# EAGLE design anaMoCo (EAGLE 6.2)
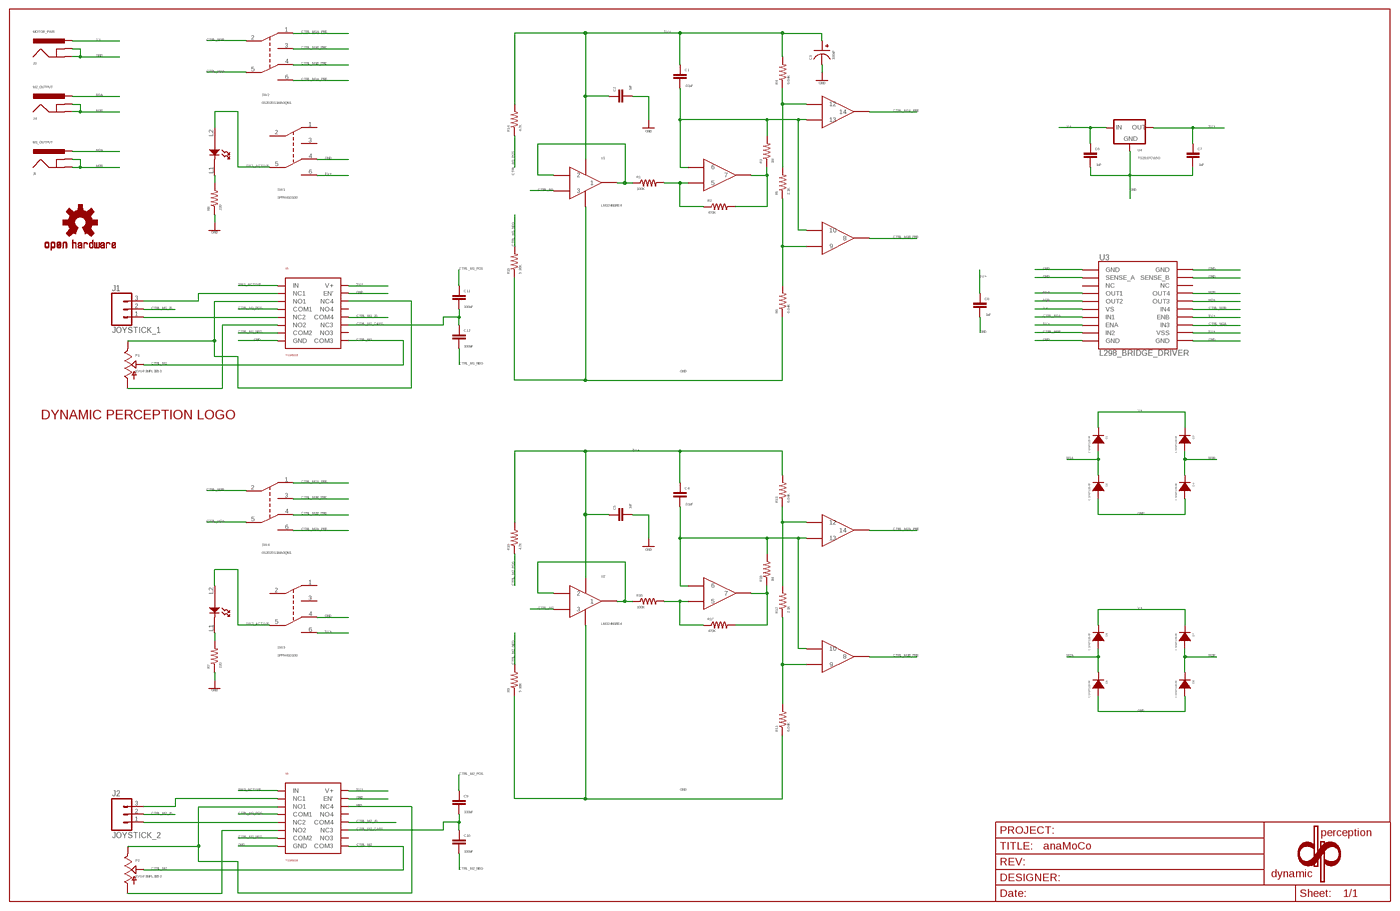
[diagram p0: schematic, sheet 1, overview]
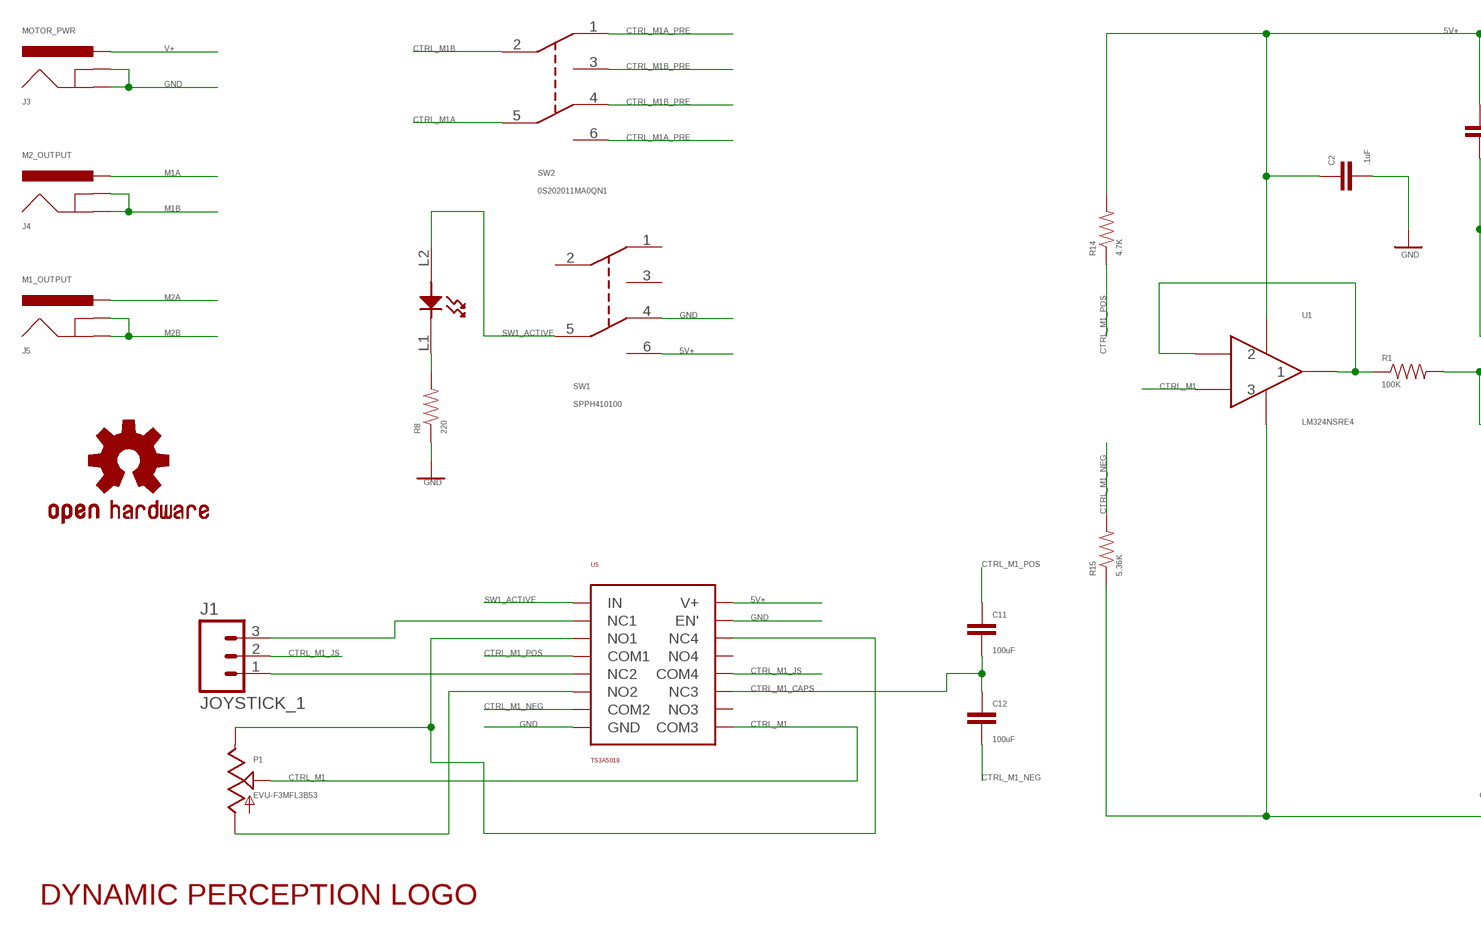
[diagram p1: schematic, sheet 1, part 1 of 4]
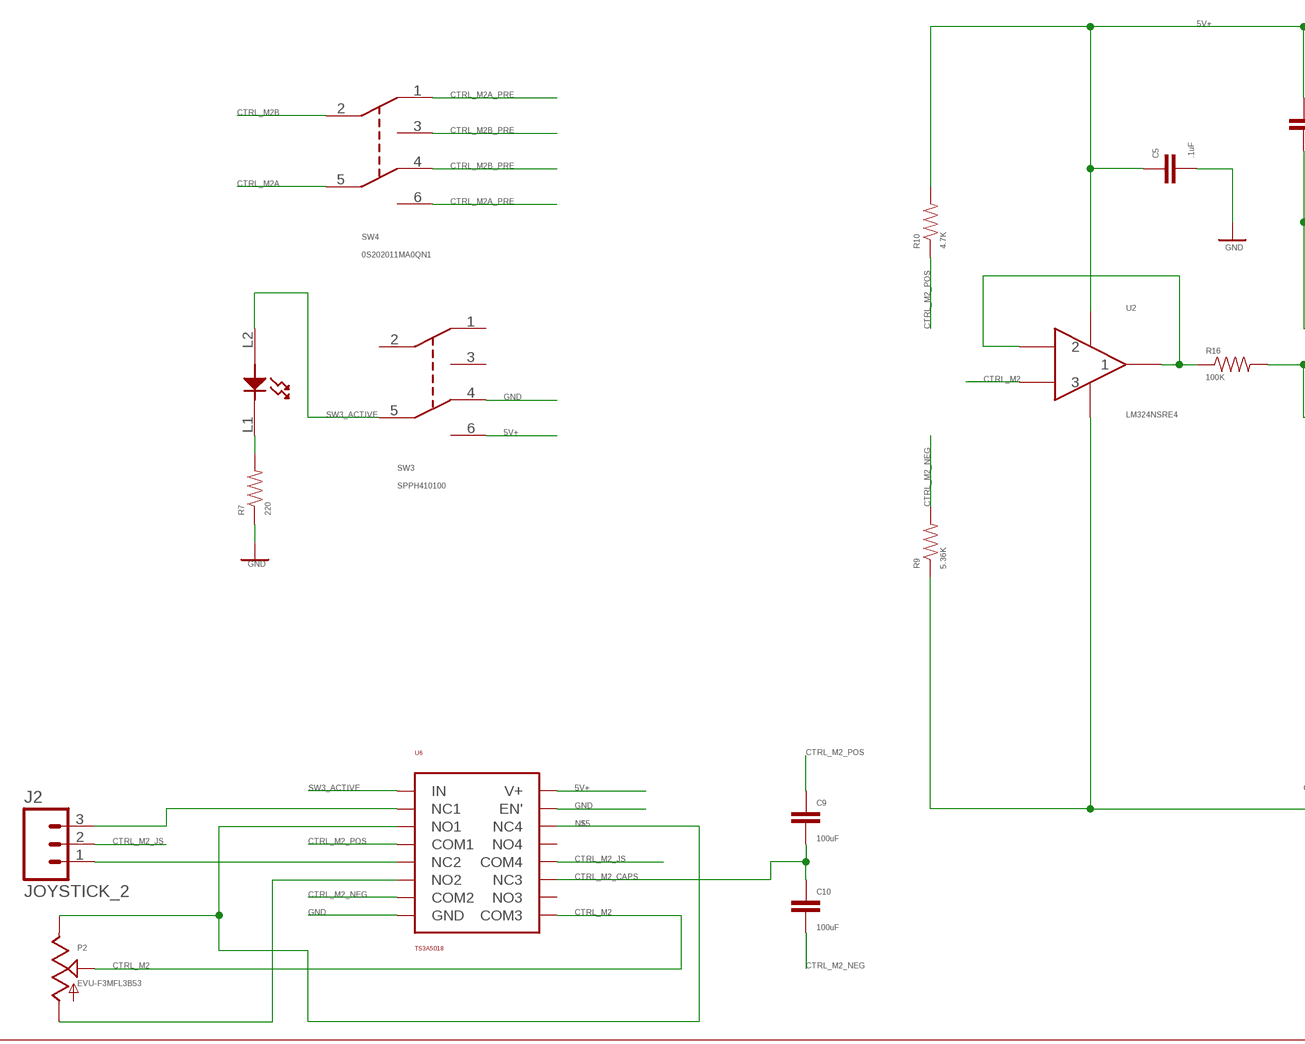
[diagram p2: schematic, sheet 1, part 2 of 4]
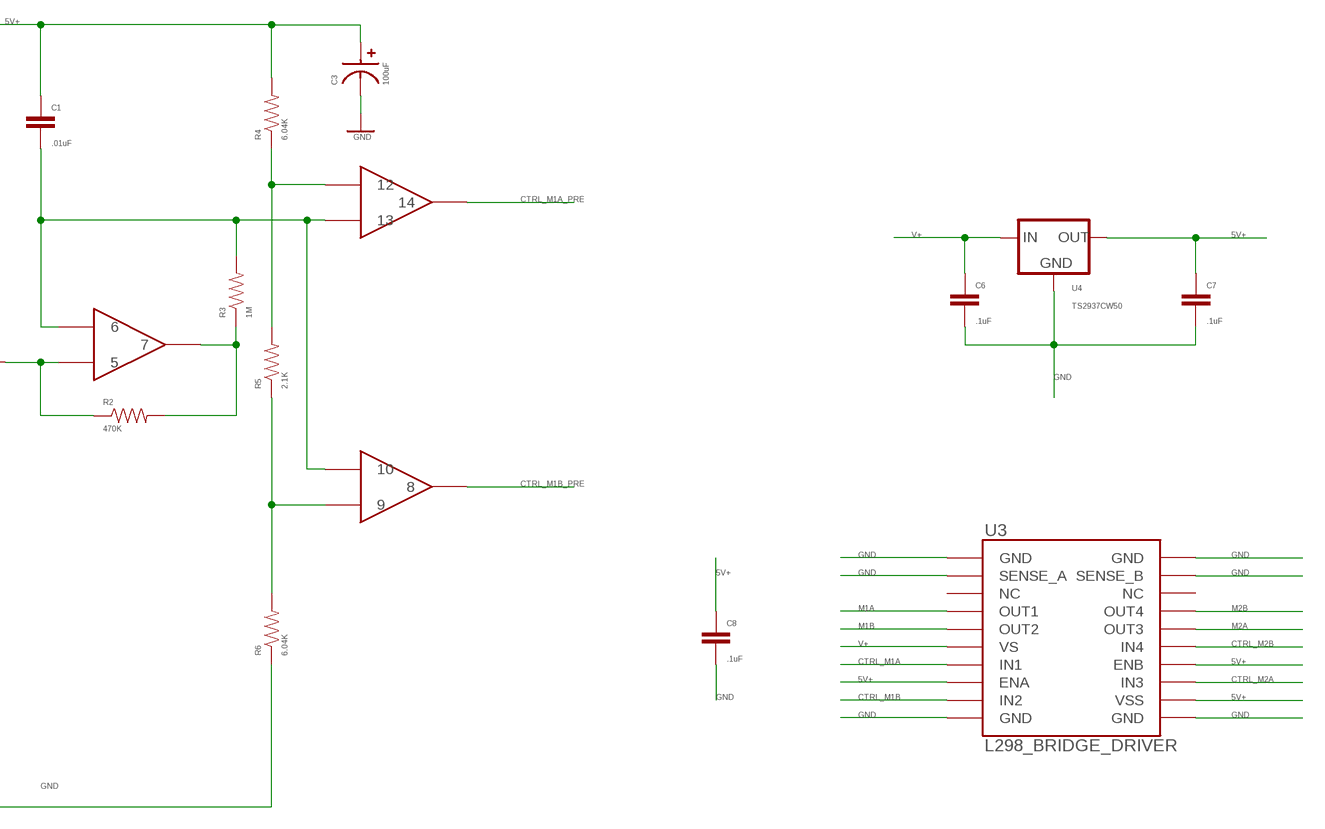
[diagram p3: schematic, sheet 1, part 3 of 4]
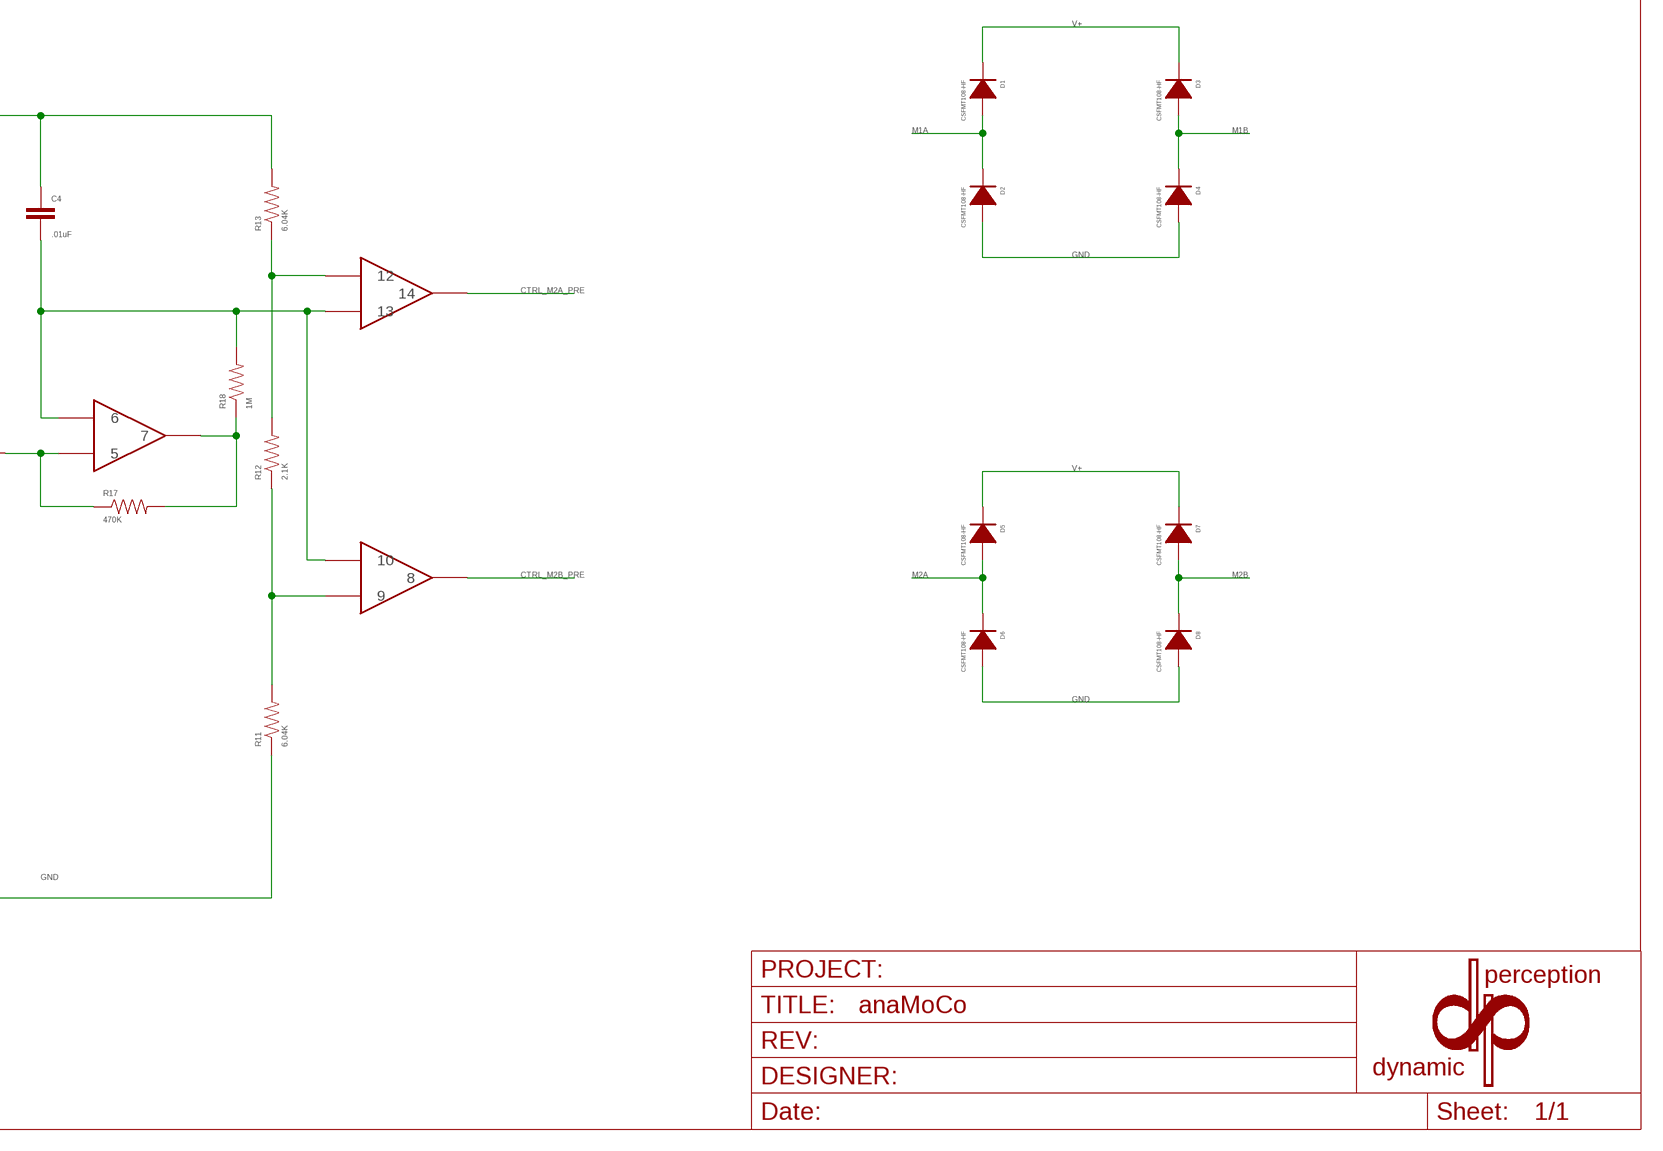
[diagram p4: schematic, sheet 1, part 4 of 4]

## Parts
C1  .01uF  CAP_NONPOL0402  [0402_CAP]
C2  .1uF  CAP_NONPOL0402  [0402_CAP]
C3  100uF  CAP_POLARIZED6.3MM_SMD  [6.3MM_DIA_CAP_SMD]
C4  .01uF  CAP_NONPOL0402  [0402_CAP]
C5  .1uF  CAP_NONPOL0402  [0402_CAP]
C6  .1uF  CAP_NONPOL0402  [0402_CAP]
C7  .1uF  CAP_NONPOL0402  [0402_CAP]
C8  .1uF  CAP_NONPOL0402  [0402_CAP]
C9  100uF  CAP1206  [1206]
C10  100uF  CAP1206  [1206]
C11  100uF  CAP1206  [1206]
C12  100uF  CAP1206  [1206]
D1  CSFMT108-HF  1N4148WSOD-123  [SOD-123]
D2  CSFMT108-HF  1N4148WSOD-123  [SOD-123]
D3  CSFMT108-HF  1N4148WSOD-123  [SOD-123]
D4  CSFMT108-HF  1N4148WSOD-123  [SOD-123]
D5  CSFMT108-HF  1N4148WSOD-123  [SOD-123]
D6  CSFMT108-HF  1N4148WSOD-123  [SOD-123]
D7  CSFMT108-HF  1N4148WSOD-123  [SOD-123]
D8  CSFMT108-HF  1N4148WSOD-123  [SOD-123]
J1  JOYSTICK_1  M03POLAR  [MOLEX-1X3]
J2  JOYSTICK_2  M03POLAR  [MOLEX-1X3]
J3  MOTOR_PWR  POWER_JACKPTH  [POWER_JACK_PTH]
J4  M2_OUTPUT  POWER_JACKPTH  [POWER_JACK_PTH]
J5  M1_OUTPUT  POWER_JACKPTH  [POWER_JACK_PTH]
LOGO1  DP_LOGOLARGE  [DP_LOGO_LARGE]
P1  EVU-F3MFL3B53  POTENTIOMETERPTV09A-4  [PTV09A-4_POT]
P2  EVU-F3MFL3B53  POTENTIOMETERPTV09A-4  [PTV09A-4_POT]
R1  100K  RESISTOR0402  [0402_RES]
R2  470K  RESISTOR0402  [0402_RES]
R3  1M  RESISTOR0402  [0402_RES]
R4  6.04K  RESISTOR0402  [0402_RES]
R5  2.1K  RESISTOR0402  [0402_RES]
R6  6.04K  RESISTOR0402  [0402_RES]
R7  220  RESISTOR0402  [0402_RES]
R8  220  RESISTOR0402  [0402_RES]
R9  5.36K  RESISTOR0402  [0402_RES]
R10  4.7K  RESISTOR0402  [0402_RES]
R11  6.04K  RESISTOR0402  [0402_RES]
R12  2.1K  RESISTOR0402  [0402_RES]
R13  6.04K  RESISTOR0402  [0402_RES]
R14  4.7K  RESISTOR0402  [0402_RES]
R15  5.36K  RESISTOR0402  [0402_RES]
R16  100K  RESISTOR0402  [0402_RES]
R17  470K  RESISTOR0402  [0402_RES]
R18  1M  RESISTOR0402  [0402_RES]
SW1  SPPH410100  PS004_SWPS004  [PS004_SW]
SW2  0S202011MA0QN1  DPDTOS202011MA0QN1  [OS202011MA0QN1]
SW3  SPPH410100  PS004_SWPS004  [PS004_SW]
SW4  0S202011MA0QN1  DPDTOS202011MA0QN1  [OS202011MA0QN1]
U1  LM324NSRE4  LM324SOP-14  [SOP-14]
U2  LM324NSRE4  LM324SOP-14  [SOP-14]
U3  L298_BRIDGE_DRIVER  [POWERSO20]
U4  TS2937CW50  V_REG_MIC2920  [SOT223]
U5  TS3A5018  TS3A5018TTSOP-16  [TTSOP-16]
U6  TS3A5018  TS3A5018TTSOP-16  [TTSOP-16]
U$1  OSHW-LOGOM  [OSHW-LOGO-M]
U$2  DP_FRAME  [DP_FRAME]

## Nets
5V+: C1.1 C2.1 C3.POS C4.1 C5.1 C7.1 C8.1 R4.2 R10.2 R13.2 R14.2 SW1.6 SW3.6 U1.4 U2.4 U3.8(ENA) U3.12(VSS) U3.14(ENB) U4.3(OUT) U5.16(V+) U6.16(V+)
BIAS2: R5.1 R6.2 U1.9
BIAS4: R11.2 R12.1 U2.9
BLAH: R4.1 R5.2 U1.12
BLAH2: R12.2 R13.1 U2.12
CTRL_M1: P1.2 U1.3 U5.9(COM3)
CTRL_M1_CAPS: C11.2 C12.1 U5.11(NC3)
CTRL_M1_JS: J1.2 U5.12(COM4)
CTRL_M1_NEG: C12.2 R15.2 U5.7(COM2)
CTRL_M1_POS: C11.1 R14.1 U5.4(COM1)
CTRL_M1A: SW2.5 U3.7(IN1)
CTRL_M1A_PRE: SW2.1 SW2.6 U1.14
CTRL_M1B: SW2.2 U3.9(IN2)
CTRL_M1B_PRE: SW2.3 SW2.4 U1.8
CTRL_M2: P2.2 U2.3 U6.9(COM3)
CTRL_M2_CAPS: C9.2 C10.1 U6.11(NC3)
CTRL_M2_JS: J2.2 U6.12(COM4)
CTRL_M2_NEG: C10.2 R9.2 U6.7(COM2)
CTRL_M2_POS: C9.1 R10.1 U6.4(COM1)
CTRL_M2A: SW4.5 U3.13(IN3)
CTRL_M2A_PRE: SW4.1 SW4.6 U2.14
CTRL_M2B: SW4.2 U3.15(IN4)
CTRL_M2B_PRE: SW4.3 SW4.4 U2.8
GND: C2.2 C3.NEG C5.2 C6.2 C7.2 C8.2 D2.ANODE D4.ANODE D6.ANODE D8.ANODE J3.GND J3.GNDBREAK R6.1 R7.1 R8.1 R9.1 R11.1 R15.1 SW1.4 SW3.4 U1.11 U2.11 U3.1(GND) U3.2(SENSE_A) U3.10(GND) U3.11(GND) U3.19(SENSE_B) U3.20(GND) U4.2(GND) U5.8(GND) U5.15(EN') U6.8(GND) U6.15(EN')
M1A: D1.ANODE D2.CATHODE J4.PWR U3.4(OUT1)
M1B: D3.ANODE D4.CATHODE J4.GND J4.GNDBREAK U3.5(OUT2)
M2A: D5.ANODE D6.CATHODE J5.PWR U3.16(OUT3)
M2B: D7.ANODE D8.CATHODE J5.GND J5.GNDBREAK U3.17(OUT4)
N$1: R1.1 U1.1 U1.2
N$2: R1.2 R2.1 U1.5
N$3: R2.2 R3.1 U1.7
N$4: C1.2 R3.2 U1.6 U1.10 U1.13
N$5: P2.1 U6.3(NO1) U6.14(NC4)
N$6: P2.3 U6.6(NO2)
N$7: R8.2 SW1.L1(L2)
N$9: P1.1 U5.3(NO1) U5.14(NC4)
N$10: R7.2 SW3.L1(L2)
N$12: J2.3 U6.2(NC1)
N$13: J2.1 U6.5(NC2)
N$14: J1.3 U5.2(NC1)
N$15: J1.1 U5.5(NC2)
N$19: R16.1 U2.1 U2.2
N$20: R16.2 R17.1 U2.5
N$21: R17.2 R18.1 U2.7
N$22: C4.2 R18.2 U2.6 U2.10 U2.13
N$23: P1.3 U5.6(NO2)
SW1_ACTIVE: SW1.5 SW1.L2(L1) U5.1(IN)
SW3_ACTIVE: SW3.5 SW3.L2(L1) U6.1(IN)
V+: C6.1 D1.CATHODE D3.CATHODE D5.CATHODE D7.CATHODE J3.PWR U3.6(VS) U4.1(IN)
Unconnected: SW1.1 SW1.2 SW1.3 SW3.1 SW3.2 SW3.3 U3.3(NC) U3.18(NC) U5.10(NO3) U5.13(NO4) U6.10(NO3) U6.13(NO4)

## Library data of the parts
C1 C2 C4-C8 = parkers_parts:CAP_NONPOL
C3 = parkers_parts:CAP_POLARIZED
C9-C12 = SparkFun-Passives:CAP: Capacitor Standard 0603 ceramic capacitor, and 0.1" leaded capacitor.
D1-D8 = parkers_parts:1N4148W: Mouser Part #: 78-1N4148W-VGS18 Manufacturer Part #: 1N4148W-V-GS18 Manufacturer: Vishay Semiconductors Description: Diodes (General Purpose, Power, Switching) 100 Volt 500mA 4ns Datasheet: 1N4148W http://www.mouser.com/Search/ProductDetail.aspx?R=1N4148W-V-GS18virtualkey61370000virtualkey78-1N4148W-VGS18
J1 J2 = SparkFun-Connectors:M03: Header 3 Standard 3-pin 0.1" header. Use with straight break away headers (SKU : PRT-00116), right angle break away headers (PRT-00553), swiss pins (PRT-00743), machine pins (PRT-00117), and female headers (PRT-00115). Molex polarized connector foot print use with SKU : PRT-08232 with associated crimp pins and housings.
J3-J5 = SparkFun-Connectors:POWER_JACK: Power Jack This is the standard 5.5mm barrel jack for power. The PTH is the most common, proven, reliable, footprint. All others are experimental. The Slot footprint only works if the mill layer is transmitted to the PCB fab house so be warned. Spark Fun Electronics SKU : PRT-00119. Mating wall wart : TOL-00298 (and others)
LOGO1 = parkers_parts:DP_LOGO
P1 P2 = parkers_parts:POTENTIOMETER
R1-R18 = parkers_parts:RESISTOR
SW1 SW3 = parkers_parts:PS004_SW: Mouser Part #: 107-PS322 Manufacturer Part #: PS004-L22NPR1AXTURXX Manufacturer: Well Buying Description: Pushbutton Switches PUSH SW DPDT ON-ON ULTRA RED LED Datasheet: PS004
SW2 SW4 = parkers_parts:DPDT
U1 U2 = parkers_parts:LM324: Mouser Part #: 595-LM324NSRE4 Manufacturer Part #: LM324NSRE4 Manufacturer: Texas Instruments Description: Operational Amplifiers - Op Amps Quad General-Purpose Op Amp Datasheet: LM324 http://www.mouser.com/Search/ProductDetail.aspx?R=LM324NSRE4virtualkey59500000virtualkey595-LM324NSRE4
U3 = SparkFun-PowerIC:L298_BRIDGE_DRIVER: Full-bridge power driver IC
U4 = SparkFun-PowerIC:V_REG_MIC2920: MIC2920A (http://www.micrel.com/_PDF/mic2920.pdf) - 400mA output LDO Regulator
U5 U6 = parkers_parts:TS3A5018: Mouser Part #: 595-TS3A5018PWG4 Manufacturer Part #: TS3A5018PWG4 Manufacturer: Texas Instruments Description: Analog Switch ICs 10O Quad SPDT Ana Sw Datasheet: TS3A5018.pdf http://www.mouser.com/Search/ProductDetail.aspx?R=TS3A5018PWG4virtualkey59500000virtualkey595-TS3A5018PWG4
U$1 = SparkFun-Aesthetics:OSHW-LOGO: Open Source Hardware Logo This logo indicates the piece of hardware it is found on incorporates a OSHW license and/or adheres to the definition of open source hardware found here: http://freedomdefined.org/OSHW
U$2 = parkers_parts:DP_FRAME; DNAME: PARKER DILLMANN; PNAME: anaMoCo; REVNUM: 7

## Board
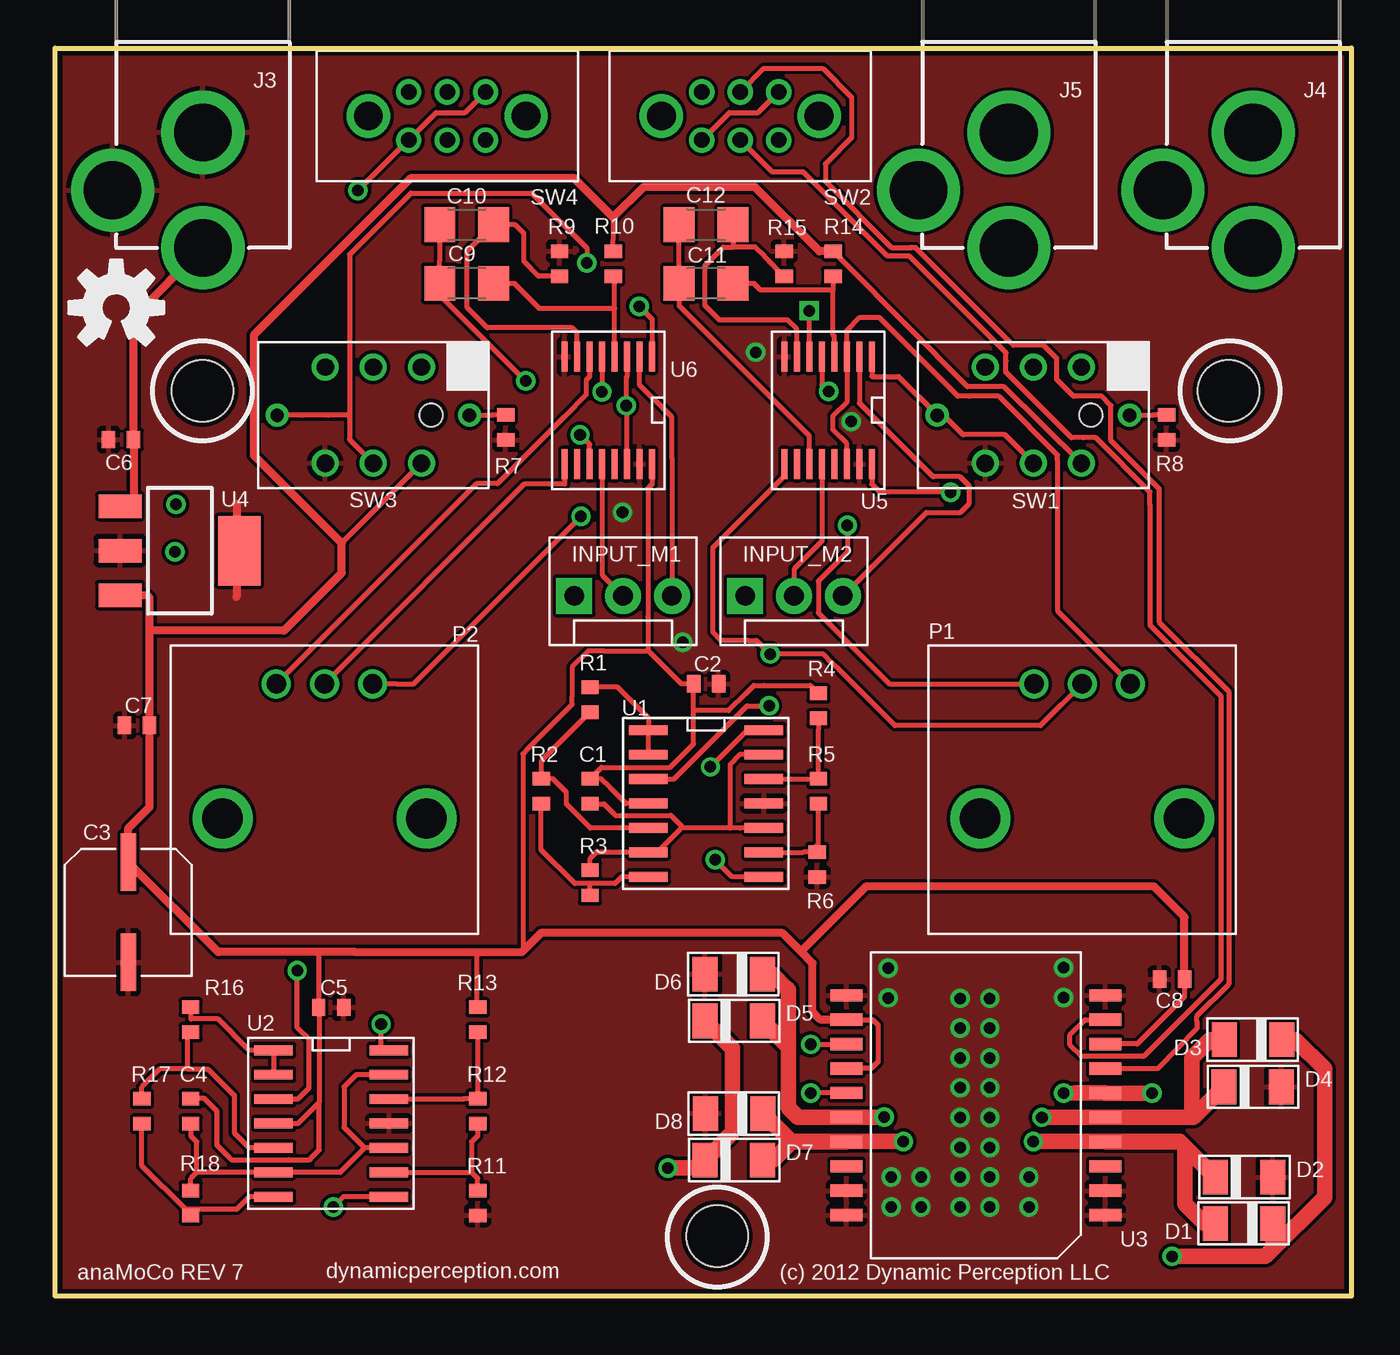
[diagram p5: board, top side]
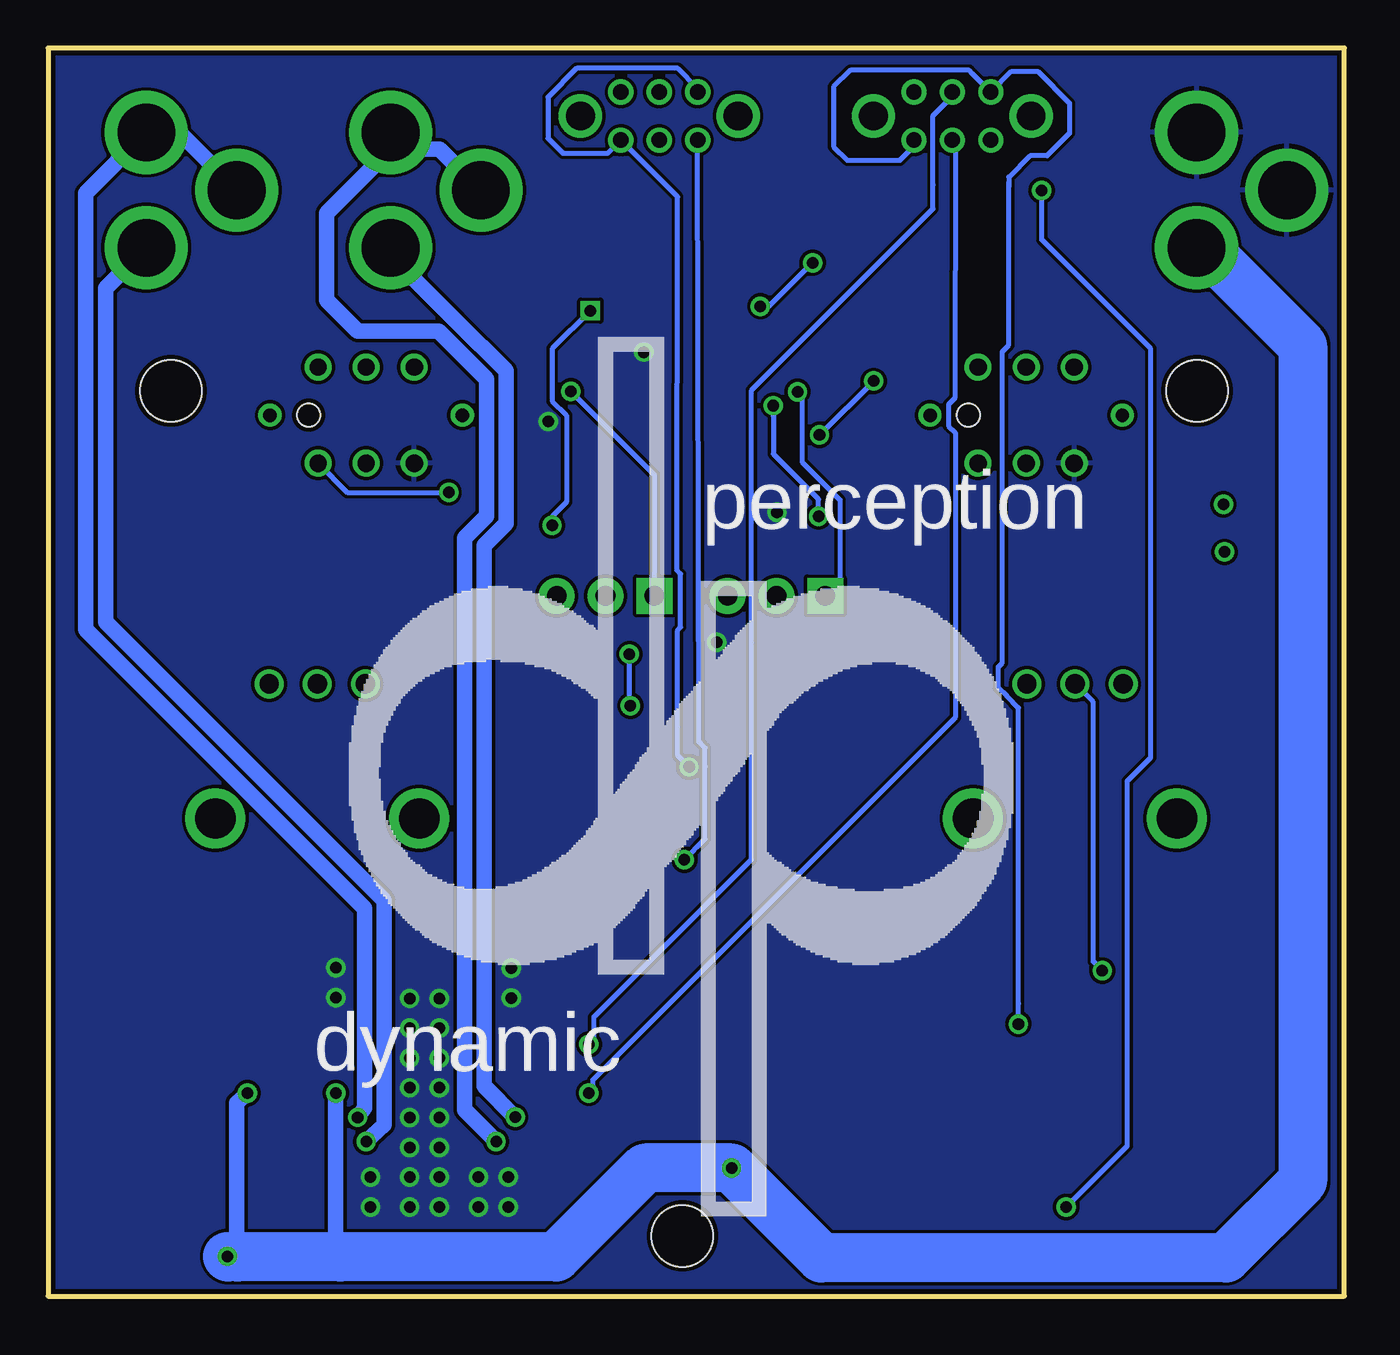
[diagram p6: board, bottom side, seen from below]

Size 67.4 x 64.9 mm. Coordinates in mm from the lower left corner, seen from the top.
Outline: 0,64.9 67.4,64.9 67.4,0 0,0 0,64.9
Copper layers (1*16): Top 0.035mm / dielectric 1.5mm / Bottom 0.035mm
Design rules: minimum track width 7mil, minimum drill 8mil, track to track 7mil, track to pad 7mil, pad to pad 7mil, via to via 7mil, smd to smd 7mil, copper to edge 10mil, drill to drill 8mil, minimum pad ring 10mil, minimum via ring 8mil, stop-mask expansion 4mil, vias tented up to drill 25mil, thermal gap 10mil
Holes 3.2 mm at 7.65,47.08 61.02,47.08 34.41,3.14

### Footprints (pad centres in the part's own frame; a part is rotated, then mirrored left to right if it is on the bottom)
0402_CAP = smd 0.7 x 0.9: 1 -0.65,0; 2 0.65,0
6.3MM_DIA_CAP_SMD = smd 0.8 x 3: NEG 0,-2.6; POS 0,2.6
1206 = smd 1.6 x 1.8: 1 -1.4,0; 2 1.4,0
SOD-123 = smd 1.3 x 1.8: ANODE 1.73,0; CATHODE -1.27,0
MOLEX-1X3 = drill 1.016 pad 1.88 square: 1 0,0 | drill 1.016 pad 1.88: 2 2.54,0; 3 5.08,0
POWER_JACK_PTH = drill 2.997 pad 4.318: GND 0,7.7; GNDBREAK 4.7,10.7; PWR 0,13.7
PTV09A-4_POT = drill 1: 1 -2.5,0; 2 0,0; 3 2.5,0 | drill 2.1: P$5 -5.3,7; P$6 5.3,7
0402_RES = smd 0.7 x 0.9: 1 -0.65,0; 2 0.65,0
PS004_SW = drill 0.9: 1 -2.5,2.5; 2 0,2.5; 3 2.5,2.5; 4 -2.5,-2.5; 5 0,-2.5; 6 2.5,-2.5 | drill 0.7: L1 5,0; L2 -5,0 | hole 1.2: 3,0
OS202011MA0QN1 = drill 0.8: 1 -2,1.25; 2 0,1.25; 3 2,1.25; 4 -2,-1.25; 5 0,-1.25; 6 2,-1.25 | drill 1.5: P$7 4.1,0; P$8 -4.1,0
SOP-14 = smd 0.51 x 2: 1 -3.81,-2.675; 2 -2.54,-2.675; 3 -1.27,-2.675; 4 0,-2.675; 5 1.27,-2.675; 6 2.54,-2.675; 7 3.81,-2.675; 8 3.81,3.325; 9 2.54,3.325; 10 1.27,3.325; 11 0,3.325; 12 -1.27,3.325; 13 -2.54,3.325; 14 -3.81,3.325
POWERSO20 = smd 1.651 x 0.635: 1 -6.731,5.715; 2 -6.731,4.445; 3 -6.731,3.175; 4 -6.731,1.905; 5 -6.731,0.635; 6 -6.731,-0.635; 7 -6.731,-1.905; 8 -6.731,-3.175; 9 -6.731,-4.445; 10 -6.731,-5.715; 11 6.731,-5.715; 12 6.731,-4.445; 13 6.731,-3.175; 14 6.731,-1.905; 15 6.731,-0.635; 16 6.731,0.635; 17 6.731,1.905; 18 6.731,3.175; 19 6.731,4.445; 20 6.731,5.715
SOT223 = smd 1.219 x 2.235: 1 -2.311,-3.099; 2 0,-3.099; 3 2.311,-3.099 | smd 3.6 x 2.2: 4 0,3.099
TTSOP-16 = smd 0.3 x 1.55: 1 -2.275,-2.8; 2 -1.625,-2.8; 3 -0.975,-2.8; 4 -0.325,-2.8; 5 0.325,-2.8; 6 0.975,-2.8; 7 1.625,-2.8; 8 2.275,-2.8; 9 2.275,2.8; 10 1.625,2.8; 11 0.975,2.8; 12 0.325,2.8; 13 -0.325,2.8; 14 -0.975,2.8; 15 -1.625,2.8; 16 -2.275,2.8

### Placement (x,y rotation side)
C1  27.81,26.25 270 top
C2  33.84,31.84 0 top
C3  3.81,19.97 0 top
C4  7.05,9.61 270 top
C5  14.35,15.01 0 top
C6  3.43,44.54 180 top
C7  4.25,29.68 180 top
C8  58.07,16.49 180 top
C9  21.4,52.67 180 top
C10  21.4,55.72 0 top
C11  33.84,52.67 180 top
C12  33.84,55.72 0 top
D1  62.05,3.79 180 top
D2  61.59,6.19 0 top
D3  62.52,13.34 180 top
D4  62.04,10.88 0 top
D5  35.05,14.31 0 top
D6  35.51,16.75 180 top
D7  35.05,7.07 0 top
D8  35.53,9.5 180 top
J1  35.87,36.41 0 top
J2  26.98,36.41 0 top
J3  7.68,68.21 180 top
J4  62.29,68.21 180 top
J5  49.59,68.21 180 top
LOGO1  51.69,4.22 0 bottom
P1  53.4,31.84 180 top
P2  14,31.84 180 top
R1  27.81,31.01 270 top
R2  25.27,26.25 270 top
R3  27.81,21.49 90 top
R4  39.68,30.7 90 top
R5  39.68,26.25 90 top
R6  39.62,22.44 90 top
R7  23.43,45.17 90 top
R8  57.78,45.17 90 top
R9  26.22,53.68 270 top
R10  29.02,53.68 90 top
R11  21.97,4.85 90 top
R12  21.97,9.61 90 top
R13  21.97,14.38 90 top
R14  40.45,53.68 90 top
R15  37.91,53.68 270 top
R16  7.05,14.38 270 top
R17  4.5,9.61 270 top
R18  7.05,4.85 90 top
SW1  50.86,45.81 0 top
SW2  35.62,61.37 180 top
SW3  16.54,45.81 0 top
SW4  20.38,61.37 180 top
U1  33.52,25.62 270 top
U2  14.03,8.98 270 top
U3  47.88,9.93 180 top
U4  6.47,38.76 270 top
U5  40.19,46.06 180 top
U6  28.76,46.06 180 top
U$1  3.17,51.4 0 top
U$2  -0.07,-0.16 0 top

### Tracks (layer width: path | path; a pad name or v marks a point on that pad's centre or on a via)
5V+  (via drill 0.6)
  Top 0.254: 30.86,33.56 32.58,31.84 C2.1 33.19,30.37 | 30.86,33.56 28.52,33.56 27.74,33.56 26.88,32.7 26.88,31.19 26.88,30.77 24.53,28.42 24.32,28.21 24.32,17.95 24.27,17.89 | U6.16 31.04,42.22 30.86,42.04 30.82,42 30.82,35.32 30.82,33.56 30.86,33.56 | SW1.6 49.33,47.29 47.44,47.29 41.06,53.72 R14.2 | 29.02,56.1 29.02,54.95 R10.2 | SW3.6 18.04,42.31 14.89,39.16 | U5.16 42.47,42.22 42.87,41.82 45.47,41.82 46.55,41.82 v46.57,41.8 | U2.4 12.62,8.98 13.53,9.89 13.72,10.08 | C5.1 13.72,15.01 | 13.72,15.01 13.72,16.02 13.72,17.79 13.62,17.89 | 13.72,15.01 13.72,10.08 | C4.1 7.05,10.27 7.76,10.27 8.42,9.61 8.42,7.84 9.1,7.16 9.15,7.1 12.15,7.1 13.22,7.1 arc90 13.28,7.16 13.6,7.48 13.72,7.61 13.72,10.08 | R13.2 21.93,15.07 21.93,17.89 | 33.19,30.37 33.19,28.73 31.96,27.5 28.4,27.5 C1.1 28.39,26.9 28.84,26.46 29.68,25.62 U1.4 | 33.19,30.37 33.27,30.44 35.01,30.44 35.91,31.35 36.33,31.76 36.87,31.76 39.27,31.76 R4.2 | U3.12 42.52,14.38 42.78,14.11 42.78,12.18 42.45,11.85 41.16,11.85 U3.14 | U3.8 56.26,13.11 56.93,13.78 58.72,15.57 C8.1
  Top 0.406: R14.2 39.73,54.33 36.39,57.67 31.74,57.67 30.59,57.67 29.02,56.1 26.95,58.16 18.51,58.16 10.33,49.97 10.33,43.73 11.74,42.31 14.89,39.16 14.89,37.61 13.74,36.45 11.9,34.61 4.9,34.61 | 4.9,34.61 C7.1 4.9,25.43 3.81,24.33 C3.POS 8.48,17.89 13.62,17.89 15.6,17.89 21.93,17.89 24.27,17.89 | 4.9,34.61 4.9,36.31 4.76,36.45 U4.3 | U3.12 39.8,14.38 39.38,14.8 39.38,17.31 38.77,17.92 | 38.77,17.92 37.8,18.89 25.26,18.89 24.32,17.95 | C8.1 58.72,19.71 57.13,21.3 42.15,21.3 38.77,17.92
  Bottom 0.254: SW1.6 51.87,41.82 51.85,41.8 v46.57,41.8
BIAS2
  Top 0.254: 39.26,23.09 39.68,23.51 R5.1 | 39.26,23.09 38.9,23.09 38.89,23.08 U1.9 | R6.2 39.26,23.09
BIAS4
  Top 0.254: R12.1 21.97,8.35 21.65,8.03 21.65,6.44 | 21.65,6.44 21.97,6.12 R11.2 | U2.9 21.65,6.44
BLAH
  Top 0.254: R4.1 39.68,29.43 R5.2 38.13,26.9 38.12,26.89 U1.12
BLAH2
  Top 0.254: U2.12 21.24,10.25 21.25,10.27 R12.2 R13.1
CTRL_M1  (via drill 0.6)
  Top 0.254: P1.2 52.33,30.77 51.23,29.68 43.65,29.68 40.8,32.53 40.39,32.93 39.94,33.39 v37.17,33.39 36.46,34.1 36.03,34.1 34.63,34.1 34.2,34.53 34.2,38.93 37.92,42.65 U5.9 | U1.3 32.12,26.89 32.17,26.89 35.21,29.93 35.98,30.7 v37.12,30.7
  Bottom 0.254: v37.12,30.7 37.17,30.75 v37.17,33.39
CTRL_M1_CAPS
  Top 0.254: C12.1 C11.2 32.44,51.5 39.22,44.73 U5.11
CTRL_M1_JS
  Top 0.254: U5.12 39.87,39.26 38.41,37.81 J1.2
CTRL_M1_NEG
  Top 0.254: 35.24,54.55 34.74,54.55 33.79,53.6 33.79,51.49 33.8,51.49 34.53,50.76 38.08,50.76 38.57,50.28 U5.7 | C12.2 35.24,54.55 | 37.29,53.65 36.89,54.05 | 36.89,54.05 36.39,54.55 35.24,54.55 | R15.2 36.89,54.05
CTRL_M1_POS
  Top 0.254: U5.4 40.52,49.91 40.41,50.01 40.41,52.31 | C11.1 36.31,52.67 36.66,52.31 40.41,52.31 | 40.41,52.31 40.45,52.35 40.45,52.42 R14.1
CTRL_M1A
  Top 0.254: SW2.5 36.85,63.84 39.91,63.84 41.41,62.34 41.41,60.24 40.04,58.87 40.04,57.98 43.49,54.52 44.43,54.52 | 44.43,54.52 44.56,54.52 | 44.43,54.52 44.74,54.52 49.56,49.7 49.82,49.44 51.39,49.44 52.08,48.76 52.08,47.66 52.94,46.8 54.42,46.8 54.9,46.32 54.9,44.49 57.39,42 57.39,41.16 57.39,35.07 61.05,31.41 61.05,16.24 59.37,14.57 59.37,14.29 59.37,13.93 57.31,11.82 54.62,11.82 U3.7
CTRL_M1A_PRE  (via drill 0.6)
  Top 0.254: U1.14 35.98,29.43 v34.07,27.52
  Bottom 0.254: v34.07,27.52 34.67,28.12 34.67,29.6 34.67,34.62 34.5,34.79 34.5,37.55 34.71,37.76 34.67,57.17 35.92,58.42 SW2.1 38.31,59.42 40.62,59.42 41.41,60.21 41.41,62.34 39.91,63.84 34.66,63.84 33.62,62.81 SW2.6
CTRL_M1B
  Top 0.254: SW2.2 37.29,58.45 38.91,58.45 41.01,56.35 43.27,54.09 44.41,54.09 49.44,49.06 49.44,48.63 49.43,48.62 49.43,48.05 52.84,44.64 53.44,44.64 54.11,44.64 56.93,41.83 56.93,41.15 56.93,34.89 60.61,31.21 60.61,16.47 58.89,14.75 56.6,12.46 53.35,12.46 52.77,13.04 52.77,13.6 53.54,14.38 U3.9
CTRL_M1B_PRE  (via drill 0.6)
  Top 0.254: SW2.3 35.05,61.55 36.55,61.55 SW2.4 | U1.8 35.2,21.81 v34.31,22.69
  Bottom 0.254: 33.95,23.05 v34.31,22.69 33.95,23.05 | 33.95,23.05 33.62,23.38 33.23,23.77 33.23,27.52 33.23,28.51 33.54,28.82 33.56,28.82 SW2.3
CTRL_M2  (via drill 0.6)
  Top 0.254: U2.3 12.62,10.25 13.05,10.68 13.19,10.82 13.19,13.35 12.58,13.96 v12.58,16.93 | P2.2 24.38,42.22 26.49,42.22 U6.9
  Bottom 0.254: v12.58,16.93 13.05,17.4 13.05,30.89 P2.2
CTRL_M2_CAPS  (via drill 0.6)
  Top 0.254: 27.76,44.31 27.79,44.31 27.79,44.3 | C10.1 20,54.55 20,53.83 20,53.39 C9.2 20,52.06 v24.47,47.59 | U6.11 27.79,44.3 | 27.79,44.3 v27.29,44.79
  Bottom 0.254: v27.29,44.79 27.26,44.79 v24.47,47.59
CTRL_M2_JS
  Top 0.254: U6.12 28.44,37.5 J2.2
CTRL_M2_NEG
  Top 0.254: R9.2 25.14,53.03 24.37,53.81 24.37,55.26 23.91,55.72 C10.2 21.42,54.34 21.42,51.4 22.16,50.66 22.46,50.36 26.88,50.36 27.14,50.1 U6.7
CTRL_M2_POS
  Top 0.254: C9.1 23.86,52.67 24.11,52.42 25.16,51.37 29.09,51.37 | U6.4 29.09,51.37 | 29.09,51.37 29.09,52.96 R10.1
CTRL_M2A  (via drill 0.6)
  Top 0.254: v39.28,13.09 41.13,13.09 U3.13
  Bottom 0.254: SW4.5 20.38,62.39 21.38,61.39 21.38,57.77 21.38,56.54 30.03,47.89 30.77,47.16 30.82,47.11 30.82,33.97 30.82,22.71 30.85,22.68 39.04,14.49 39.04,13.34 v39.28,13.09
CTRL_M2A_PRE  (via drill 0.6)
  Top 0.254: U2.14 16.95,12.79 v16.95,14.15
  Bottom 0.254: 16.95,15.2 v16.95,14.15 16.95,15.2 | 16.95,15.2 16.95,30.59 17.53,31.17 17.99,31.64 17.99,32.73 17.79,32.93 17.79,49.11 17.44,49.46 17.44,57.67 | SW4.1 22.38,59.79 23.1,59.07 25.84,59.07 26.55,59.78 26.55,62.88 25.69,63.74 19.51,63.74 19.34,63.58 SW4.6 17.31,63.69 15.94,63.69 14.28,62.04 14.28,60.47 15.45,59.3 16.34,59.3 17.44,58.2 17.44,57.67 | 17.44,57.67 17.44,57.9
CTRL_M2B  (via drill 0.6)
  Top 0.254: U3.15 v39.28,10.57
  Bottom 0.254: SW4.2 20.23,59.97 20.25,46.7 20.58,46.37 20.58,45.25 20.23,44.9 20.23,30.1 39.07,11.26 39.07,10.78 v39.28,10.57
CTRL_M2B_PRE  (via drill 0.6)
  Top 0.254: SW4.4 21.31,61.55 19.81,61.55 SW4.3 18.36,60.12 v15.73,57.49 | U2.8 14.99,5.17 v14.46,4.64
  Bottom 0.254: 14.09,5 v14.46,4.64 14.09,5 | 14.09,5 11.29,7.81 11.29,26.79 10.07,28 10.07,49.26 15.73,54.93 v15.73,57.49
GND  (via drill 0.6)
  Top 0.406: 9.43,41.21 9.43,36.36
  other vias: 32.62,34 41.39,45.48 36.43,49.09 29.5,40.76 47.05,13.93 48.6,13.93 47.05,15.48 48.6,15.48 47.05,12.38 48.6,12.38 47.05,10.83 48.6,10.83 47.05,9.28 48.6,9.28 47.05,7.74 48.6,7.74 47.05,6.19 48.6,6.19 47.05,4.64 48.6,4.64 43.47,6.19 45.02,6.19 43.47,4.64 45.02,4.64 50.63,6.19 50.63,4.64 43.32,15.51 43.32,17.06 52.43,15.53 52.43,17.08
  pour Bottom (rank 6): 0.38,64.54 67.05,64.54 67.05,0.34 0.38,0.34
  pour Top (rank 6): 0.38,64.54 67.05,64.54 67.05,0.34 0.38,0.34
M1A  (via drill 0.6)
  Top 0.813: U3.4 58.48,8.03 | 58.48,8.03 58.52,7.98 | 58.52,7.98 D2.CATHODE | D1.ANODE 59.76,3.79 58.73,4.81 58.73,7.77 58.52,7.98 | 58.48,8.03 58.47,8.04 v50.86,8.04
  Bottom 0.813: v50.86,8.04 49.92,8.9 49.92,20.59 64.4,35.07 64.4,50.2 64.4,52.41 J4.PWR
M1B  (via drill 0.6)
  Top 0.813: 58.99,9.3 59.18,9.3 D4.CATHODE | D3.ANODE 60.04,13.34 59.09,12.38 59.09,9.4 58.99,9.3 | U3.5 v51.3,9.3 U3.5 | U3.5 58.99,9.3
  Bottom 0.813: v51.3,9.3 50.94,9.79 50.94,20.16 59.62,28.84 65.44,34.66 65.44,51.09 65.44,57.36 J4.GND 60.59,60.51 J4.GNDBREAK
M2A  (via drill 0.6)
  Top 0.813: 38.13,12.96 38.13,9.79 38.63,9.3 U3.16 41.16,9.31 v43.11,9.31 | 38.13,12.96 D5.ANODE | D6.CATHODE 37.3,16.75 37.98,16.07 38.13,15.91 38.13,12.96
  Bottom 0.813: v43.11,9.31 44.74,10.94 44.74,21.32 44.74,39.03 44.05,39.71 43.6,40.17 43.6,43.07 43.6,48.12 46.19,50.71 49.59,54.12 J5.PWR
M2B  (via drill 0.6)
  Top 0.813: U3.17 38.27,8.03 | 38.27,8.03 D8.CATHODE 38.26,8.04 42.96,8.04 v44.1,8.04 | D7.ANODE 37.32,7.07 38.27,8.03
  Bottom 0.813: v44.1,8.04 45.75,9.69 45.75,39.44 44.61,40.58 44.61,47.69 47.1,50.18 51.29,50.18 52.92,51.8 52.92,56.33 49.59,59.65 | 49.59,59.65 J5.GND | J5.GNDBREAK 47.03,59.65 49.59,59.65
N$1
  Top 0.254: R1.1 29.25,31.67 30.85,30.06 U1.1 | U1.1 31.48,29.43 | U1.2 U1.1
N$2
  Top 0.254: U1.5 27.82,24.35 26.58,25.59 26.58,26.2 25.88,26.9 R2.1 25.27,27.82 R1.2
N$3
  Top 0.254: 27.81,21.46 29.1,21.46 29.45,21.81 29.58,21.81 U1.7 | R3.1 27.81,21.46 | 27.81,21.46 27.02,21.46 25.27,23.21 R2.2
N$4
  Top 0.254: 35.09,24.35 35.58,24.35 U1.10 | 35.09,24.35 32.56,24.35 | 32.56,24.35 32.52,24.31 32.48,24.26 | 32.12,23.9 32.48,24.26 | U1.13 35.58,28.16 35.09,27.66 35.09,24.35 | C1.2 28.53,25.6 29.06,25.07 29.12,25.01 32.01,25.01 32.56,24.46 32.56,24.35 | R3.2 27.81,22.76 28.13,23.08 U1.6 31.29,23.08 32.48,24.26
N$5  (via drill 0.6)
  Top 0.254: U6.3 29.74,47.82 29.69,47.77 v29.69,46.31 29.74,46.26 U6.14 | P2.1 17.73,31.84 18.63,31.84 v27.34,40.55
  Bottom 0.254: 29.69,45.78 v29.69,46.31 29.69,45.78 | 29.69,45.78 29.69,43.8 27.76,41.86 27.34,41.45 v27.34,40.55
N$6
  Top 0.254: P2.3 14.03,34.37 21.91,42.25 23,42.25 26.49,45.74 27.61,46.87 27.61,47.65 27.79,47.82 U6.6
N$7
  Top 0.254: R8.2 57.06,45.83 57.05,45.81 SW1.L1
N$8  (via drill 0.6)
  other vias: 6.22,38.7
N$9
  Top 0.254: P1.1 52.11,35.63 52.11,43.46 52.11,43.75 49.22,46.64 49.06,46.8 47.53,46.8 46.94,46.8 arc-90 46.87,46.87 42.83,50.91 41.86,50.91 41.17,50.22 U5.3 41.18,48.85 41.18,46.52 40.45,45.78 40.45,45.05 41.17,44.33 U5.14
N$10
  Top 0.254: R7.2 22.71,45.83 22.7,45.81 SW3.L1
N$11  (via drill 0.6)
  other vias: 6.28,41.17
N$12
  Top 0.254: J2.3 32.06,43.59 32.06,43.83 32.06,45.71 30.39,47.39 U6.2
N$13  (via drill 0.6)
  Top 0.254: U6.5 v28.43,47.03
  Bottom 0.254: v28.43,47.03 28.2,46.79 28.2,43.37 26.98,42.16 26.22,41.4 26.22,37.81 26.22,37.17 J2.1
N$14
  Top 0.254: U5.2 41.82,46.44 45.64,42.61 47.05,42.61 47.53,42.13 47.53,41.82 47.53,41.22 47.07,40.75 45.3,40.75 J1.3
N$15  (via drill 0.6)
  Top 0.254: U5.5 39.87,47.39 v40.21,47.05
  Bottom 0.254: 39.84,46.67 v40.21,47.05 39.84,46.67 | 39.84,46.67 35.87,42.71 35.87,37.62 J1.1
N$19
  Top 0.254: R16.1 7.05,14.41 8.47,14.41 10.09,12.79 U2.1 U2.2
N$20
  Top 0.254: U2.5 10.09,7.71 9.31,8.49 9.31,10.45 7.94,11.82 6.87,11.82 | 6.87,11.82 5.44,11.82 4.5,10.88 R17.1 | R16.2 arc90 6.87,13.55 6.87,11.82
N$21
  Top 0.254: U2.7 10.09,5.17 9.43,4.51 7.05,4.51 | 7.05,4.51 6.78,4.51 4.5,6.78 R17.2 | R18.1 7.05,4.51
N$22
  Top 0.254: C4.2 7.05,8.35 7.37,8.03 7.37,6.44 | 7.37,6.44 7.05,6.12 R18.2 | 7.37,6.44 U2.6 14.82,6.44 16.09,7.71 | U2.10 16.09,7.71 | 16.09,11.52 U2.13 15.66,11.52 15.02,10.88 15.02,8.78 16.09,7.71
N$23  (via drill 0.6)
  Top 0.254: 41.21,38.7 v41.19,40.08 41.21,38.7 | 41.21,38.7 39.68,37.18 39.68,35.53 43.38,31.84 P1.3 | U5.6 39.22,51.23 v39.2,51.25
  Bottom 0.254: v39.2,51.25 41.18,49.26 41.18,46.55 40.45,45.81 40.45,41.29 41.17,40.57 v41.19,40.08
SW1_ACTIVE
  Top 0.254: U5.1 42.47,47.82 43.85,47.82 SW1.L2 46.19,45.81 47.2,44.79 49.38,44.79 SW1.5
SW3_ACTIVE  (via drill 0.6)
  Top 0.254: 15.3,45.78 15.3,54.17 18.5,57.36 24.78,57.36 27.64,54.5 v27.64,53.73 | 15.3,45.78 15.3,45.68 15.3,44.55 SW3.5 | 15.3,45.78 15.28,45.81 14.21,45.81 12.86,45.81 11.9,45.81 SW3.L2 | v30.36,51.47 31.04,50.8 U6.1
  Bottom 0.254: v27.64,53.73 29.91,51.47 v30.36,51.47
V+  (via drill 0.6)
  Top 0.254: 4.08,41.33 3.82,41.07 3.59,41.07 U4.1
  Top 0.406: J3.PWR 4.08,50.91 C6.1 4.08,41.33
  Top 0.813: D5.CATHODE 35.21,12.88 35.21,8.51 D7.CATHODE 33.37,6.67 v31.86,6.67 | D1.CATHODE 63.32,2.46 63.15,2.3 | 63.15,2.3 62.92,2.07 v58.07,2.07 | D3.CATHODE 64.48,13.34 66.01,11.81 66.01,5.15 63.15,2.3 | U3.6 53.06,10.57 v52.44,10.55 | v57.03,10.55 56.45,10.55 54.57,10.55
  Bottom 0.813: v31.86,6.67 31.53,6.34 | v58.07,2.07 57.59,2.07 | 57.59,2.07 57.57,2.05 | 57.59,2.07 57.59,10.05 v57.03,10.55 | v52.44,10.55 52.44,2.27 52.21,2.05
  Bottom 2.54: J3.PWR 7.26,54.51 2.17,49.42 2.17,5.98 6.16,1.99 27.19,1.99 31.53,6.34 v31.86,6.67 36.36,6.67 40.98,2.05 52.21,2.05 57.57,2.05 58.05,2.05 v58.07,2.07

### Text on the board
tPlace: anaMoCo REV 7 | dynamicperception.com | (c) 2012 Dynamic Perception LLC
tNames: INPUT_M1 | INPUT_M2 | U3